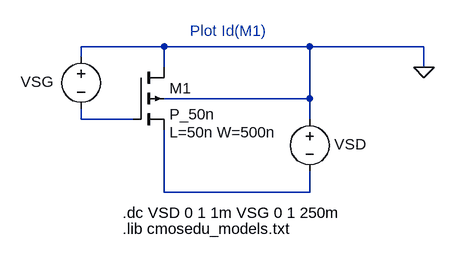
[diagram p0: schematic Fig6_19_PMOS_ID_VSD.asc]
Fig6_19_PMOS_ID_VSD.asc, the LTspice schematic file:
Version 4
SHEET 1 1224 688
WIRE 320 96 320 80
WIRE 320 192 320 176
WIRE 400 192 320 192
WIRE 448 80 320 80
WIRE 448 112 448 80
WIRE 448 304 448 208
WIRE 672 80 448 80
WIRE 672 160 448 160
WIRE 672 160 672 80
WIRE 672 192 672 160
WIRE 672 304 448 304
WIRE 672 304 672 272
WIRE 848 80 672 80
WIRE 848 112 848 80
FLAG 848 112 0
SYMBOL voltage 320 80 R0
WINDOW 0 -93 54 Left 0
WINDOW 3 24 104 Invisible 0
SYMATTR InstName VSG
SYMATTR Value 0
SYMBOL voltage 672 176 R0
WINDOW 123 0 0 Left 0
WINDOW 39 0 0 Left 0
WINDOW 0 38 54 Left 0
WINDOW 3 24 104 Invisible 0
SYMATTR InstName VSD
SYMATTR Value 0
SYMBOL pmos4 400 112 R0
WINDOW 123 56 100 Left 0
SYMATTR Value2 L=50n W=500n
SYMATTR InstName M1
SYMATTR Value P_50n
TEXT 384 336 Left 0 !.dc VSD 0 1 1m VSG 0 1 250m
TEXT 384 360 Left 0 !.lib cmosedu_models.txt
TEXT 488 56 Left 0 ;Plot Id(M1)

The netlist it stands for:
* Fig6_19_PMOS_ID_VSD.asc
VSG 0 N001 0
VSD 0 N002 0
M1 0 N001 N002 0 P_50n L=50n W=500n
.model NMOS NMOS
.model PMOS PMOS
.lib standard.mos
.dc VSD 0 1 1m VSG 0 1 250m
.lib cmosedu_models.txt
* Plot Id(M1)
.backanno
.end